# Altium schematic sheet 17-FPGA-02b.SchDoc
size B; SheetNumber: 17; SheetTotal: 19
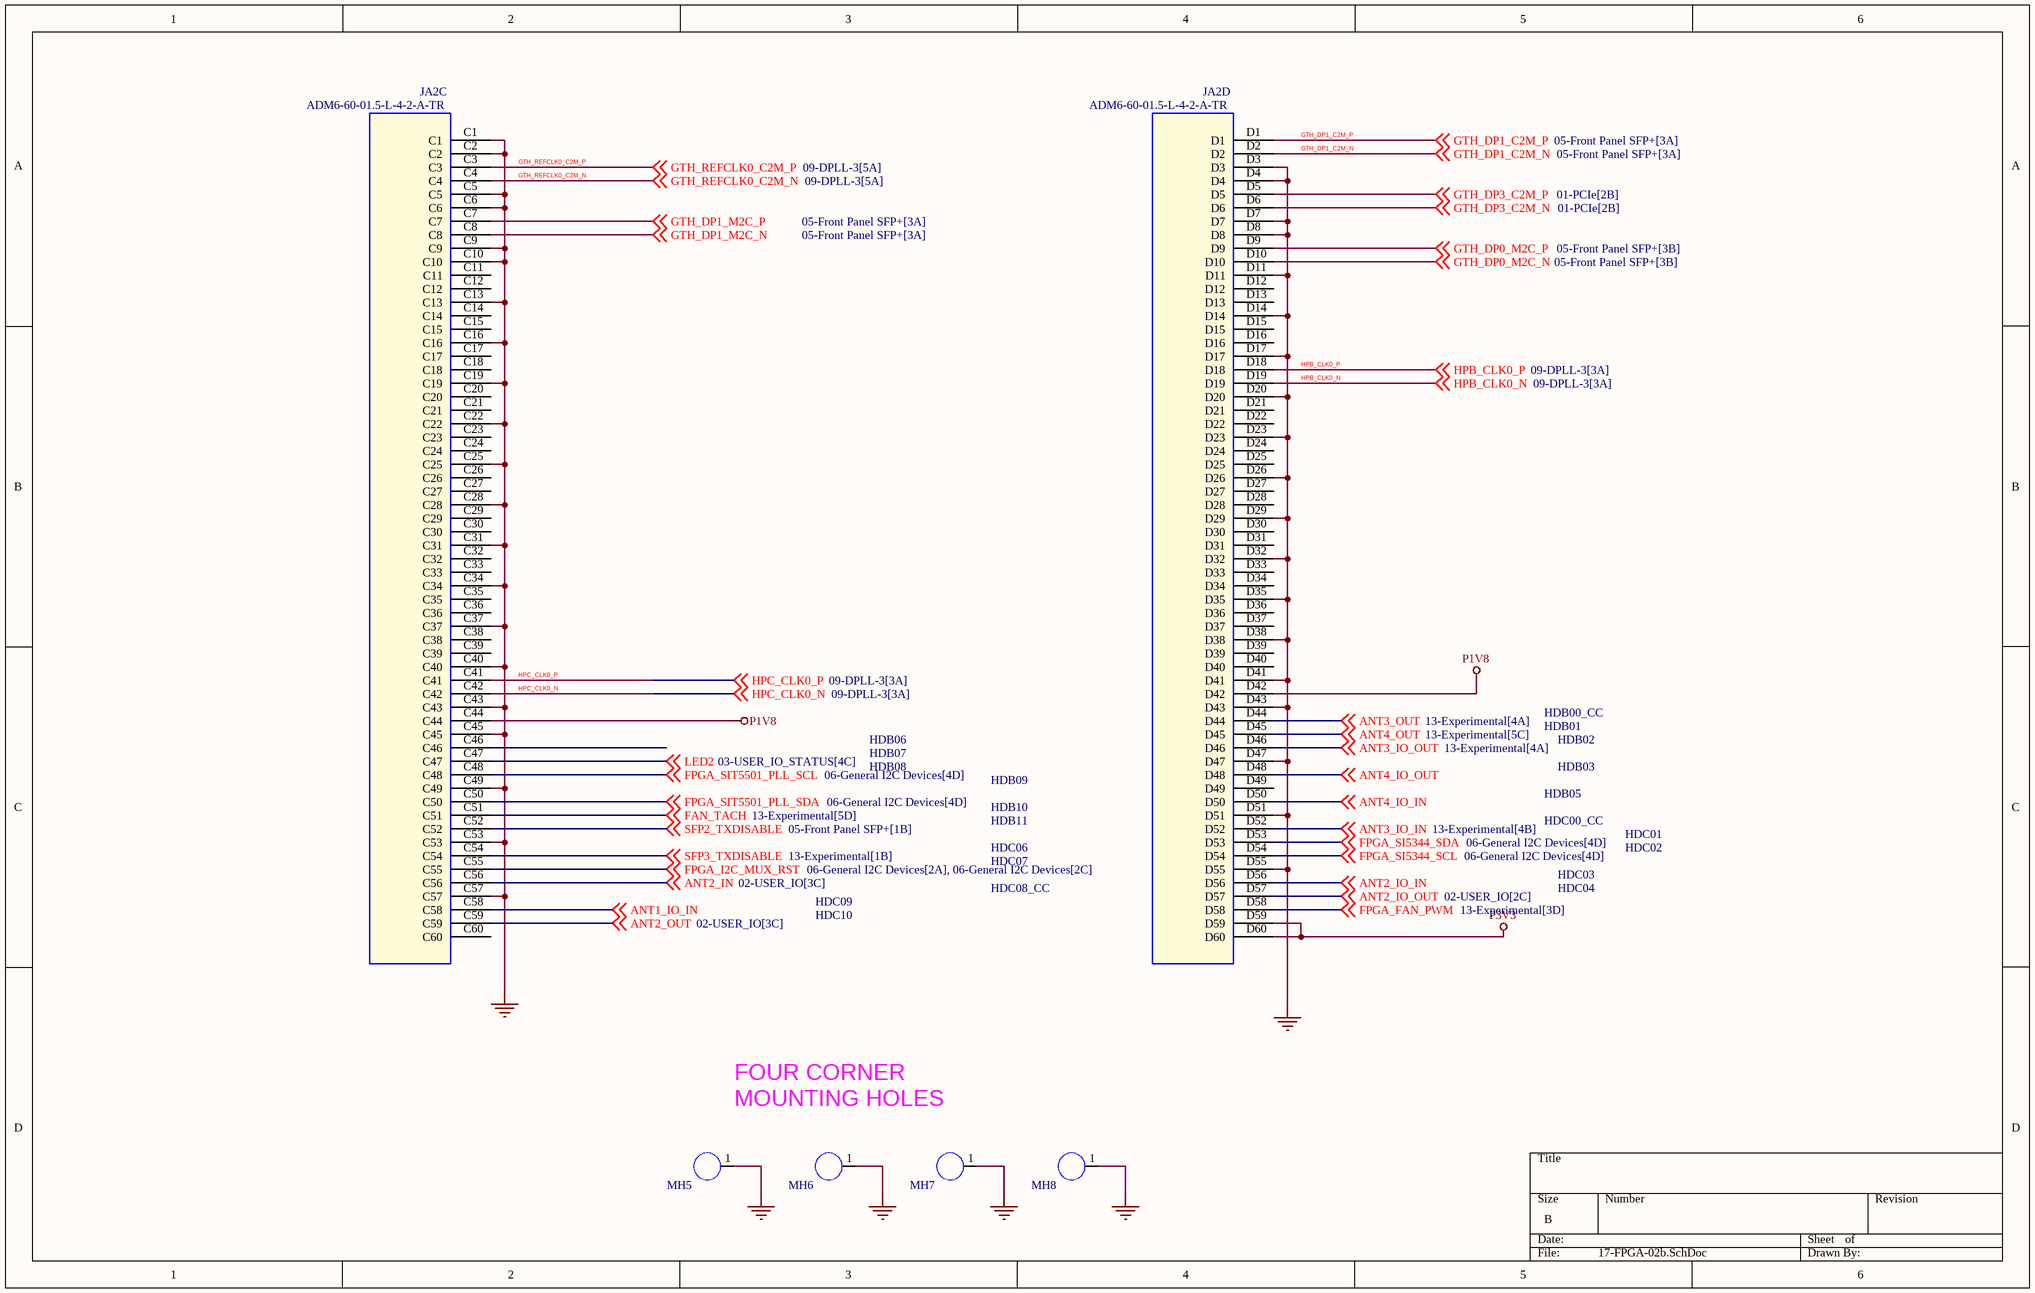
[diagram p0: 17-FPGA-02b.SchDoc]

## Parts
JA2  ADM6-60-01.5-L-4-2-A-TR  [CON_SAMTEC_ADM6_60_4]  (parts C,D of 4)
MH5  MH_NP_M3_SO_600  [MH_NP_M3_SO_600]  (value not drawn)
MH6  MH_NP_M3_SO_600  [MH_NP_M3_SO_600]  (value not drawn)
MH7  MH_NP_M3_SO_600  [MH_NP_M3_SO_600]  (value not drawn)
MH8  MH_NP_M3_SO_600  [MH_NP_M3_SO_600]  (value not drawn)

## Nets
GND: JA2.C1 JA2.C2 JA2.C5 JA2.C6 JA2.C9 JA2.C10 JA2.C13 JA2.C16 JA2.C19 JA2.C22 JA2.C25 JA2.C28 JA2.C31 JA2.C34 JA2.C37 JA2.C40 JA2.C43 JA2.C45 JA2.C49 JA2.C53 JA2.C57 JA2.D3 JA2.D4 JA2.D7 JA2.D8 JA2.D11 JA2.D14 JA2.D17 JA2.D20 JA2.D23 JA2.D26 JA2.D29 JA2.D32 JA2.D35 JA2.D38 JA2.D41 JA2.D43 JA2.D47 JA2.D51 JA2.D55 MH5.1 MH6.1 MH7.1 MH8.1
P1V8: JA2.C44 JA2.D42
P3V3: JA2.D59 JA2.D60
ANT1_IO_IN: JA2.C58 ; off-sheet ANT1_IO_IN
ANT2_IN: JA2.C56 ; off-sheet ANT2_IN
ANT2_IO_IN: JA2.D56 ; off-sheet ANT2_IO_IN
ANT2_IO_OUT: JA2.D57 ; off-sheet ANT2_IO_OUT
ANT2_OUT: JA2.C59 ; off-sheet ANT2_OUT
ANT3_IO_IN: JA2.D52 ; off-sheet ANT3_IO_IN
ANT3_IO_OUT: JA2.D46 ; off-sheet ANT3_IO_OUT
ANT3_OUT: JA2.D44 ; off-sheet ANT3_OUT
ANT4_IO_IN: JA2.D50 ; off-sheet ANT4_IO_IN
ANT4_IO_OUT: JA2.D48 ; off-sheet ANT4_IO_OUT
ANT4_OUT: JA2.D45 ; off-sheet ANT4_OUT
FAN_TACH: JA2.C51 ; off-sheet FAN_TACH
FPGA_FAN_PWM: JA2.D58 ; off-sheet FPGA_FAN_PWM
FPGA_I2C_MUX_RST: JA2.C55 ; off-sheet FPGA_I2C_MUX_RST
FPGA_SI5344_SCL: JA2.D54 ; off-sheet FPGA_SI5344_SCL
FPGA_SI5344_SDA: JA2.D53 ; off-sheet FPGA_SI5344_SDA
FPGA_SIT5501_PLL_SCL: JA2.C48 ; off-sheet FPGA_SIT5501_PLL_SCL
FPGA_SIT5501_PLL_SDA: JA2.C50 ; off-sheet FPGA_SIT5501_PLL_SDA
GTH_DP0_M2C_N: JA2.D10 ; off-sheet GTH_DP0_M2C_N
GTH_DP0_M2C_P: JA2.D9 ; off-sheet GTH_DP0_M2C_P
GTH_DP1_C2M_N: JA2.D2 ; off-sheet GTH_DP1_C2M_N
GTH_DP1_C2M_P: JA2.D1 ; off-sheet GTH_DP1_C2M_P
GTH_DP1_M2C_N: JA2.C8 ; off-sheet GTH_DP1_M2C_N
GTH_DP1_M2C_P: JA2.C7 ; off-sheet GTH_DP1_M2C_P
GTH_DP3_C2M_N: JA2.D6 ; off-sheet GTH_DP3_C2M_N
GTH_DP3_C2M_P: JA2.D5 ; off-sheet GTH_DP3_C2M_P
GTH_REFCLK0_C2M_N: JA2.C4 ; off-sheet GTH_REFCLK0_C2M_N
GTH_REFCLK0_C2M_P: JA2.C3 ; off-sheet GTH_REFCLK0_C2M_P
HPB_CLK0_N: JA2.D19 ; off-sheet HPB_CLK0_N
HPB_CLK0_P: JA2.D18 ; off-sheet HPB_CLK0_P
HPC_CLK0_N: JA2.C42 ; off-sheet HPC_CLK0_N
HPC_CLK0_P: JA2.C41 ; off-sheet HPC_CLK0_P
LED2: JA2.C47 ; off-sheet LED2
SFP2_TXDISABLE: JA2.C52 ; off-sheet SFP2_TXDISABLE
SFP3_TXDISABLE: JA2.C54 ; off-sheet SFP3_TXDISABLE

Not connected (* = marked no-connect by the designer): JA2 C11 C12 C14 C15 C17 C18 C20 C21 C23 C24 C26 C27 C29 C30 C32 C33 C35 C36 C38 C39 C46 C60 D12 D13 D15 D16 D21 D22 D24 D25 D27 D28 D30 D31 D33 D34 D36 D37 D39 D40 D49

## Notes on the sheet
- HDB06
- HDB07
- HDB08
- HDB00_CC
- HDB01
- HDB02
- HDB03
- HDB09
- HDB10
- HDB11
- HDC00_CC
- HDB05
- HDC01
- HDC09
- HDC06
- HDC07
- HDC08_CC
- HDC03
- HDC04
- HDC02
- HDC10
- FOUR CORNER
  MOUNTING HOLES

## Library data of the parts
JA2 = SAMTEC-ADx6-60X4: Conn Rcpt Male Vert 240 Pos 4x60 0.635mm P Black SMT; Manufacturer: Samtec Inc.; Agile Part Number: CON-00383-01; SPLIT_INST: TRUE; SWAP_INFO: (S1+S2+S3+S4); Barcode: 40000092; Pitch: 0.025" (0.64mm); Datasheet: http://suddendocs.samtec.com/catalog_english/adf6.pdf; Manufacturer PN: ADM6-60-01.5-L-4-2-A-TR; PCB Footprint: CON_SAMTEC_ADM6_60_4; Part Type: CONNECTOR; Number of Pins: 240; CIP Link: http://xsjbrdwin1/CIP-E/Component/Index/All?pn=40000092
MH5-MH8 = HOLE: MOUNTING HOLE, NON-PLATED 3.4MM HOLE; EDMVersionID: 490415297; Barcode: 96000044; ASSEMBLY_OPTIONS: DNP; PCB Footprint: MH_NP_M3_SO_600; CIP Link: http://xsjbrdwin1/CIP-E/Component/Index/All?pn=96000044; Part Type: HOLE